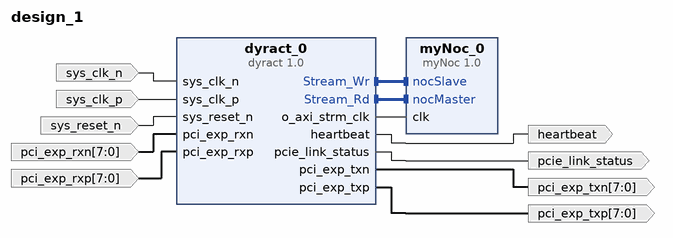
[diagram p0: block diagram of the top level]
# Vivado block design design_1, Vivado 2015.4
create_bd_design design_1

create_bd_port -dir O pcie_link_status
create_bd_port -dir O heartbeat
create_bd_port -dir I -type clk sys_clk_n
create_bd_port -dir I -type clk sys_clk_p
create_bd_port -dir I sys_reset_n
create_bd_port -dir I -from 7 -to 0 pci_exp_rxn
create_bd_port -dir I -from 7 -to 0 pci_exp_rxp
create_bd_port -dir O -from 7 -to 0 pci_exp_txp
create_bd_port -dir O -from 7 -to 0 pci_exp_txn

create_bd_cell -type ip -vlnv kulInc:user:myNoc:1.0 myNoc_0
create_bd_cell -type ip -vlnv xilinx.com:user:dyract:1.0 dyract_0

# ---- connections ----

connect_bd_intf_net [get_bd_intf_pins dyract_0/Stream_Wr] [get_bd_intf_pins myNoc_0/nocSlave]
connect_bd_intf_net [get_bd_intf_pins dyract_0/Stream_Rd] [get_bd_intf_pins myNoc_0/nocMaster]
connect_bd_net [get_bd_pins dyract_0/pcie_link_status] [get_bd_ports pcie_link_status]
connect_bd_net [get_bd_pins dyract_0/heartbeat] [get_bd_ports heartbeat]
connect_bd_net [get_bd_ports sys_clk_n] [get_bd_pins dyract_0/sys_clk_n]
connect_bd_net [get_bd_ports sys_clk_p] [get_bd_pins dyract_0/sys_clk_p]
connect_bd_net [get_bd_ports sys_reset_n] [get_bd_pins dyract_0/sys_reset_n]
connect_bd_net [get_bd_ports pci_exp_rxn] [get_bd_pins dyract_0/pci_exp_rxn]
connect_bd_net [get_bd_ports pci_exp_rxp] [get_bd_pins dyract_0/pci_exp_rxp]
connect_bd_net [get_bd_pins dyract_0/pci_exp_txp] [get_bd_ports pci_exp_txp]
connect_bd_net [get_bd_pins dyract_0/pci_exp_txn] [get_bd_ports pci_exp_txn]
connect_bd_net [get_bd_pins dyract_0/o_axi_strm_clk] [get_bd_pins myNoc_0/clk]

validate_bd_design
save_bd_design
